# EAGLE board PFCEDU_V1 (EAGLE 8.6.1), part 1 of 2
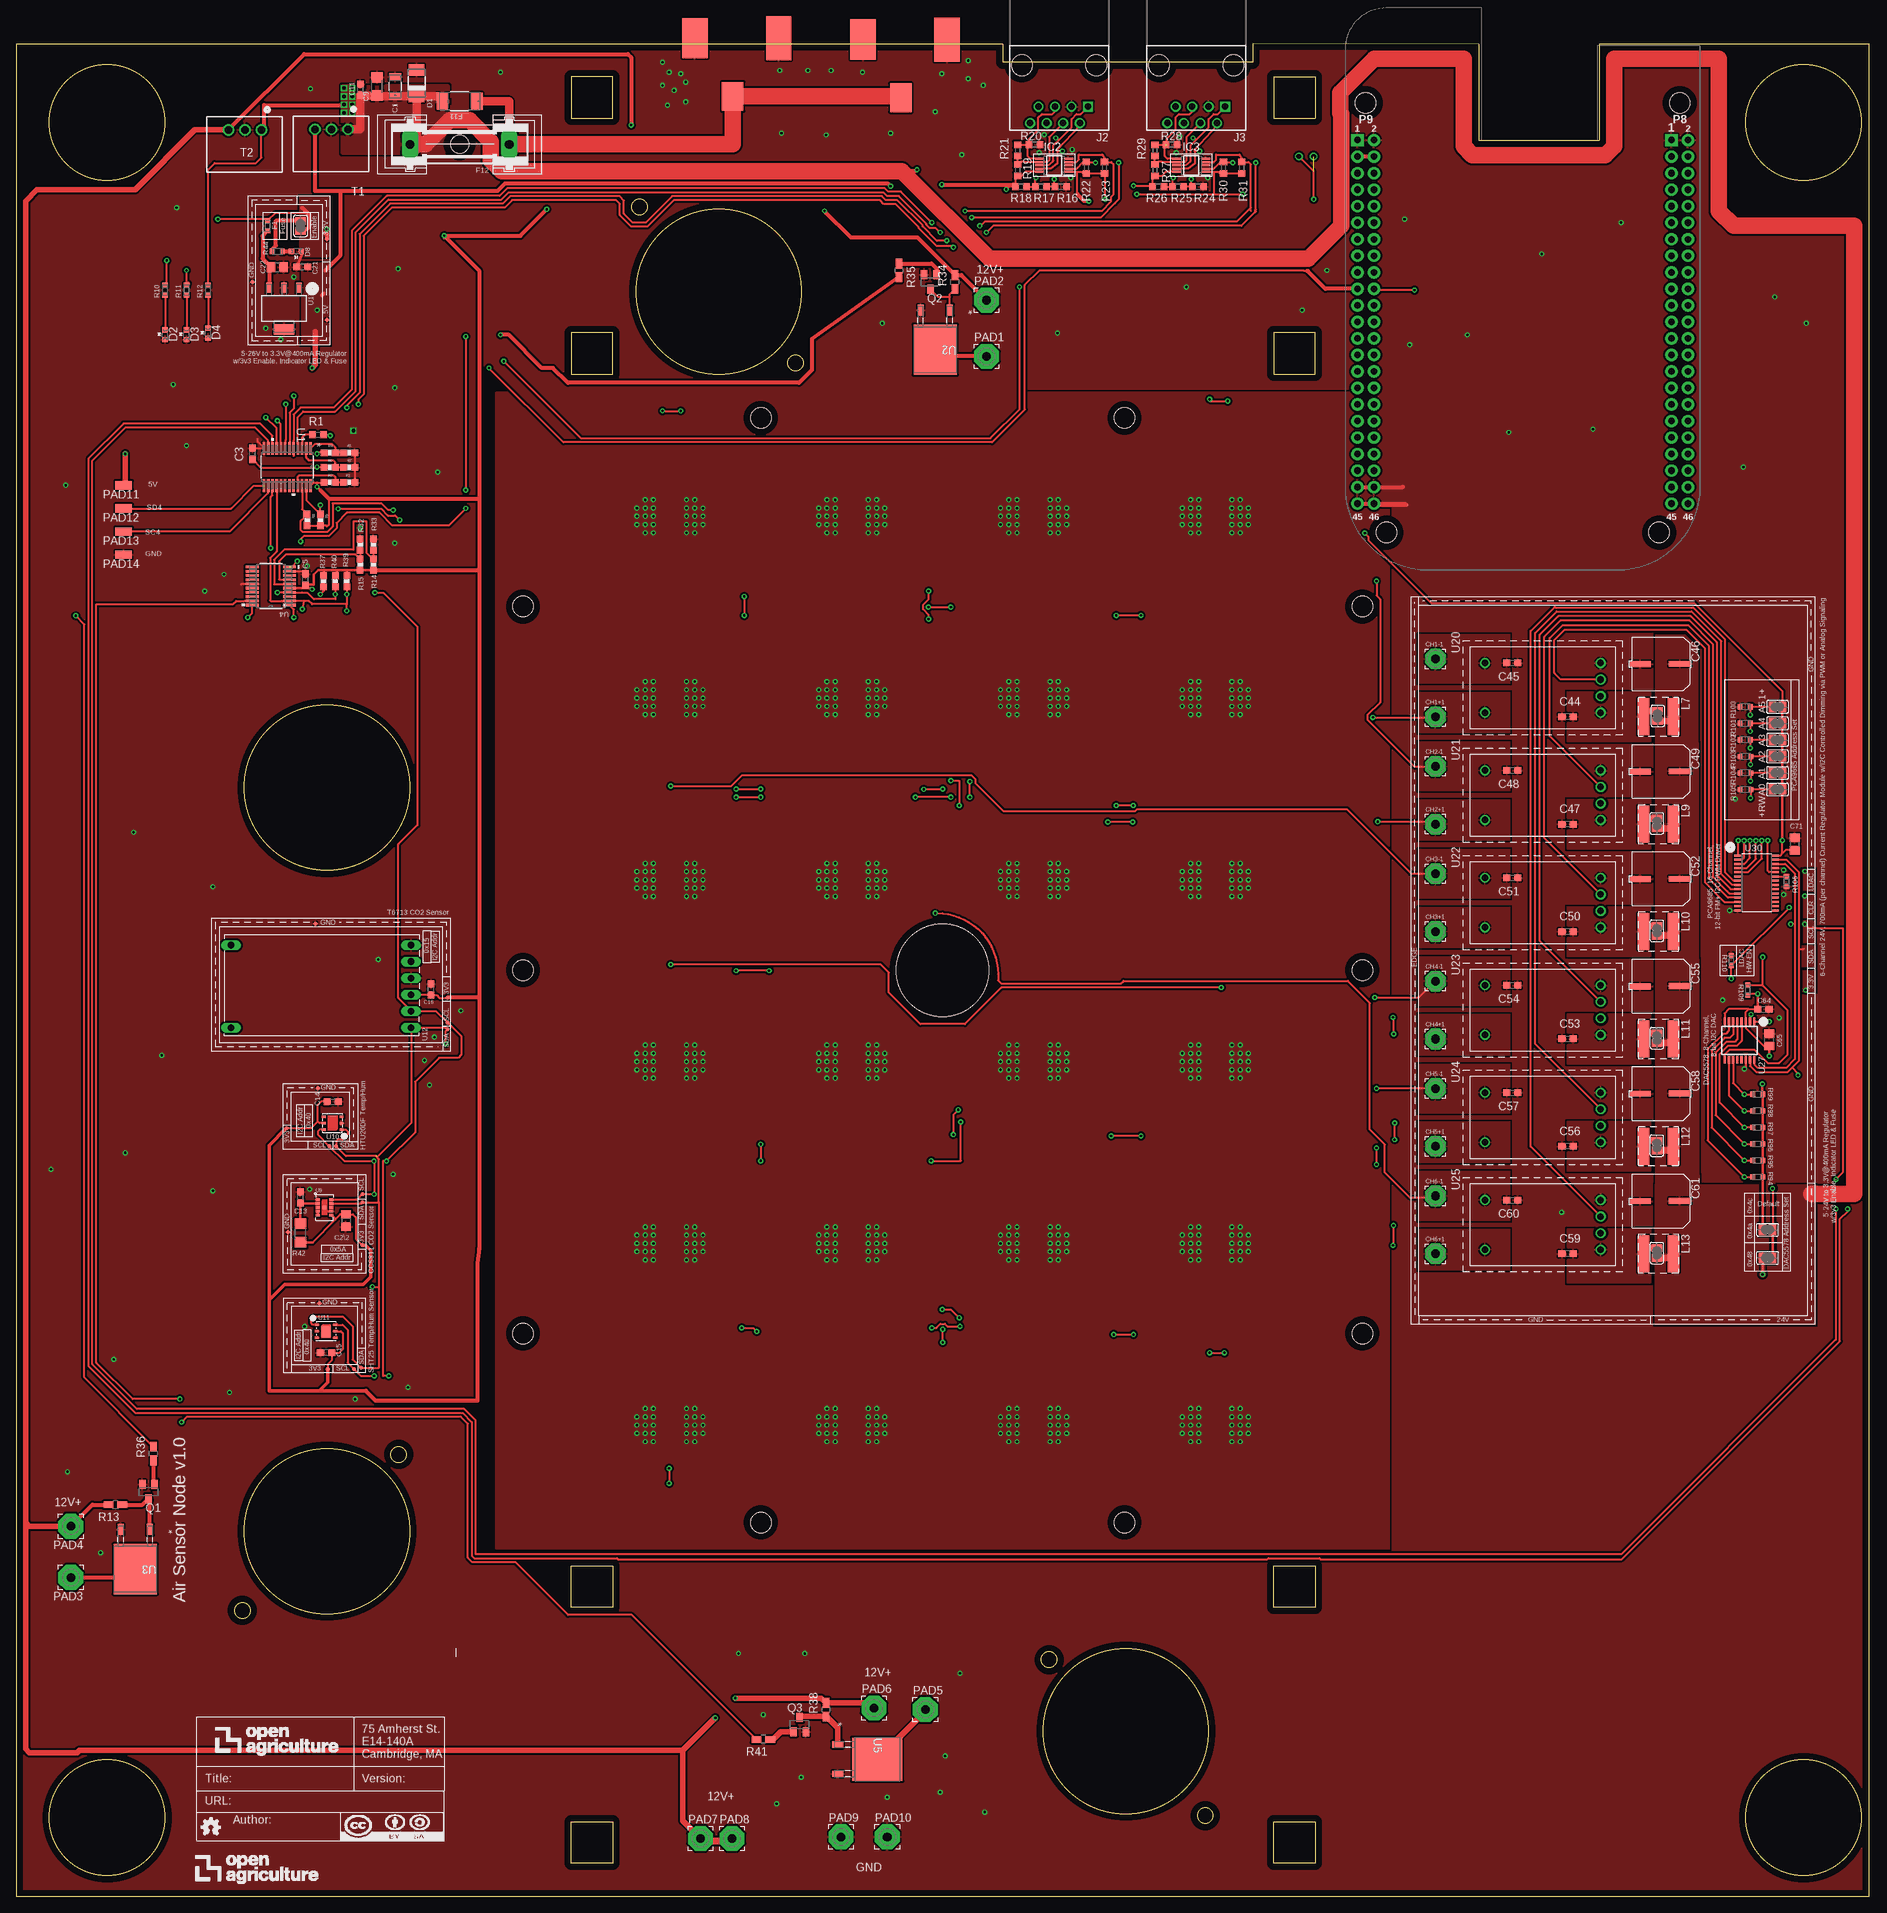
[diagram p6: board, top side]
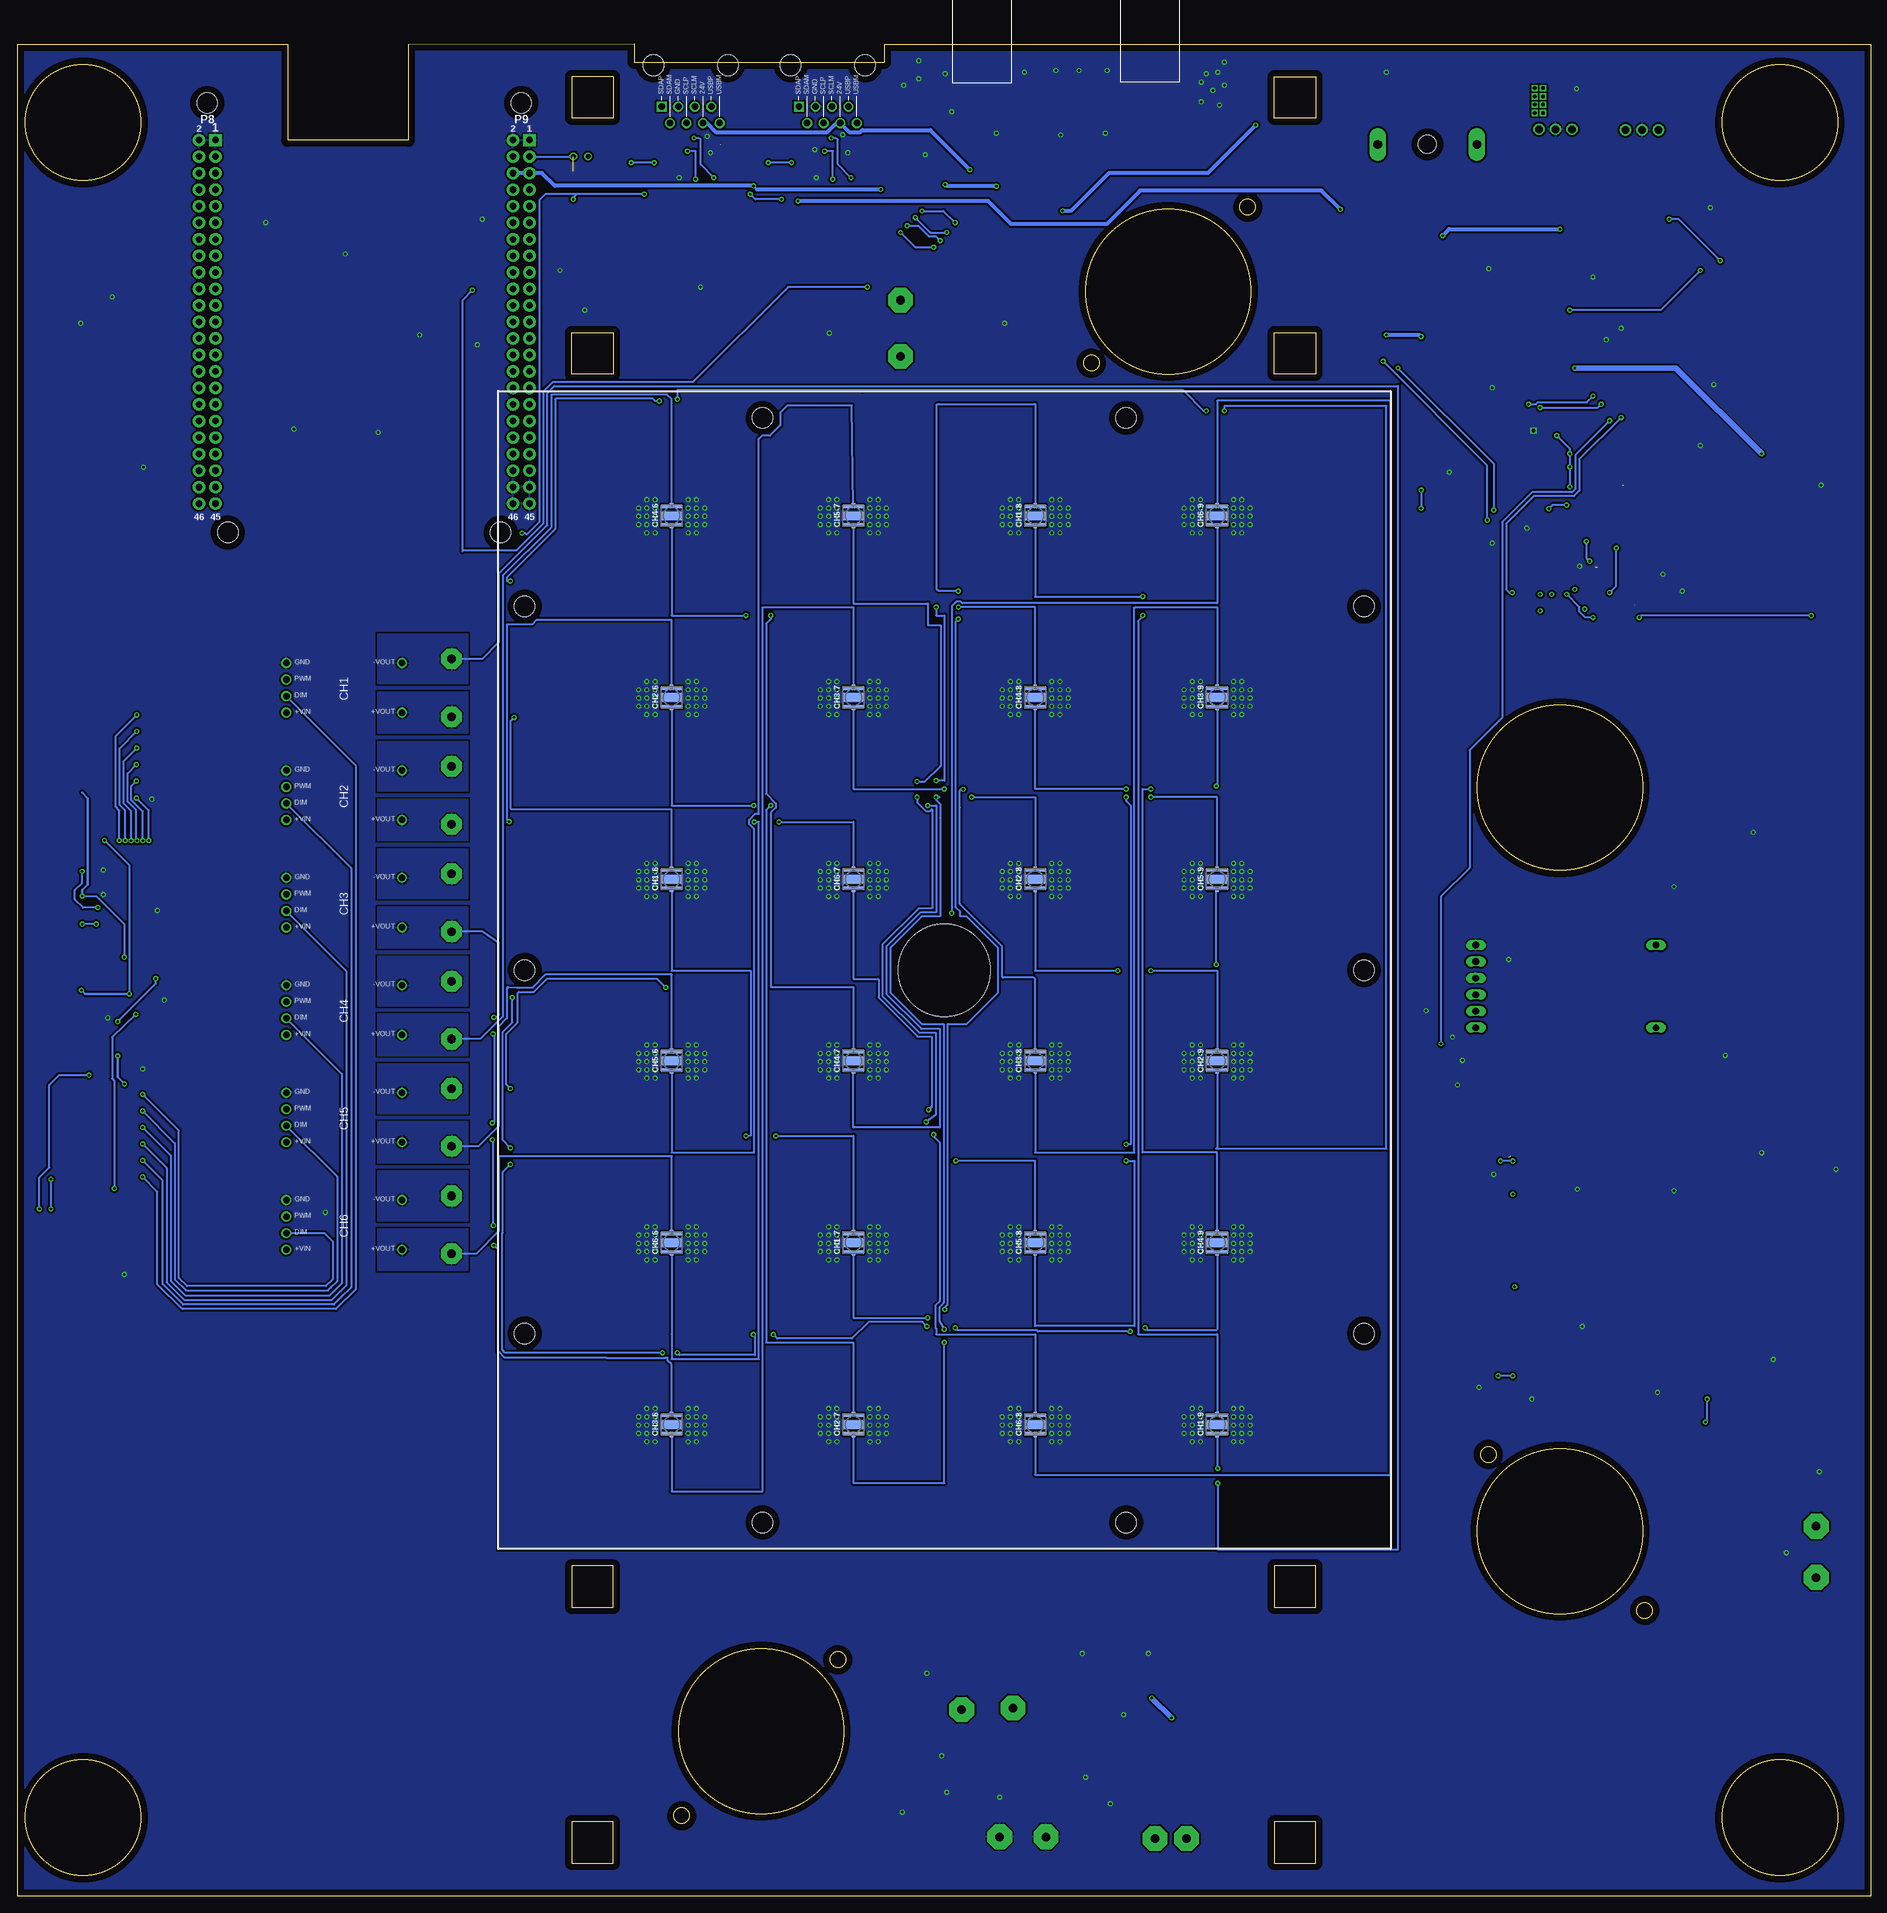
[diagram p7: board, bottom side, seen from below]

Size 284.73 x 284.79 mm. Coordinates in mm from the lower left corner, seen from the top.
Outline: 189.99,281.94 151.62,281.94 151.62,284.73 0,284.73 0,0 284.73,0 284.73,284.73 243.27,284.73 243.27,269.95 224.73,269.95 224.73,284.73 189.99,284.79 189.99,281.94
Outline: 91.66,279.71 85.31,279.71 85.31,273.36 91.66,273.36 91.66,279.71
Outline: 91.66,240.34 85.31,240.34 85.31,233.99 91.66,233.99 91.66,240.34
Outline: 199.61,240.34 193.26,240.34 193.26,233.99 199.61,233.99 199.61,240.34
Outline: 193.26,273.36 199.61,273.36 199.61,279.71 193.26,279.71 193.26,273.36
Outline: 199.61,11.43 199.61,5.08 193.26,5.08 193.26,11.43 199.61,11.43
Outline: 199.61,50.8 199.61,44.45 193.26,44.45 193.26,50.8 199.61,50.8
Outline: 91.66,11.43 91.66,5.08 85.31,5.08 85.31,11.43 91.66,11.43
Outline: 91.66,50.8 91.66,44.45 85.31,44.45 85.31,50.8 91.66,50.8
Outline: circle at 274.7,12.1 radius 8.89
Outline: circle at 13.97,12.1 radius 8.89
Outline: circle at 119.75,235.7 radius 1.2
Outline: circle at 95.76,259.68 radius 1.2
Outline: circle at 158.73,36.4 radius 1.2
Outline: circle at 182.72,12.41 radius 1.2
Outline: circle at 58.75,67.93 radius 1.2
Outline: circle at 34.76,43.94 radius 1.2
Outline: circle at 47.75,170.43 radius 12.7
Outline: circle at 47.75,56.13 radius 12.7
Outline: circle at 274.7,272.69 radius 8.89
Outline: circle at 170.53,25.4 radius 12.7
Outline: circle at 107.95,246.69 radius 12.7
Outline: circle at 13.97,272.69 radius 8.89
Copper layers (1*16): Top 0.035mm / dielectric 1.5mm / Bottom 0.035mm
Design rules "default *": minimum track width 6mil, minimum drill 0.35mm, track to track 4mil, track to pad 4mil, pad to pad 6mil, via to via 6mil, smd to smd 6mil, copper to edge 40mil, drill to drill 6mil, minimum pad ring 10mil, minimum via ring 8mil, stop-mask expansion 4mil, vias tented up to drill 25mil, thermal gap 10mil
Holes 3.17 mm at 114.43,57.48 170.31,57.48 206.86,86.51 206.86,142.39 206.86,198.27 170.31,227.28 114.43,227.28 77.88,198.27 77.88,142.39 77.88,86.51
Holes 14.22 mm at 142.37,142.37
Milling: 2 lines

## Footprints (pad centres in the part's own frame; a part is rotated, then mirrored left to right if it is on the bottom)
CAP_C1206 = smd 1.118 x 1.803: 1 -1.499,0; 2 1.499,0
C0805 = smd 1.3 x 1.5: 1 -0.95,0; 2 0.95,0
C0603@1 = smd 1.1 x 1: 1 -0.85,0; 2 0.85,0
C1206 = smd 1.6 x 1.8: 1 -1.4,0; 2 1.4,0
C0603 = smd 1.1 x 1: 1 -0.85,0; 2 0.85,0
EEE-1HA101UP = smd 0.889 x 3.404: + 0,-3.251 | smd 0.889 x 3.251: - -0.051,2.794
3,17/1,3 = drill 1.321 pad 3.175 octagon: 1 0,0
CREE-XLAMP-XP-E = smd 0.5 x 3.3: A 1.4,0; C -1.4,0 | smd 0.45 x 0.5: A@1 1.725,0; C@1 -1.725,0 | smd 1.3 x 3.3: THERM 0,0
DO-214AC = smd 1.8 x 2.4: A 2.025,0; C -2.025,0
CHIPLED_0603 = smd 0.8 x 0.8: A 0,-0.75; C 0,0.75
0603 = smd 0.756 x 0.8: 1 -0.778,0; 2 0.778,0
SS = smd 1.803 x 2.642: 1 -2.629,0; 2 2.629,0
GSH15 = drill 1.321 pad 2.54 long: 1 -7.62,0; 2 7.62,0 | hole 2.794: 0,0
SOP50P490X110-10N = smd 1.4 x 0.3: 1 -2.2,1; 2 -2.2,0.5; 3 -2.2,0; 4 -2.2,-0.5; 5 -2.2,-1; 6 2.2,-1; 7 2.2,-0.5; 8 2.2,0; 9 2.2,0.5; 10 2.2,1
OPENAG-V1-RJ45 = drill 1: 24V(6) 1.905,8.89; DSCLM(5) 0.635,6.35; DSCLP(4) -0.635,8.89; DSDAM(2) -3.175,8.89; GND(3) -1.905,6.35; USBM(8) 4.445,8.89; USBP(7) 3.175,6.35 | drill 1 square: DSDAP(1) -4.445,6.35 | hole 3.2: -5.715,0; 5.715,0
74404064121 = smd 1.8 x 5.7: 1 -2.3,0; 2 2.3,0
3,81/1,3 = drill 1.321 pad 3.81 octagon: 1 0,0
SMD1,27-2,54 = smd 1.27 x 2.54: 1 0,0
SOT23-BEC = smd 1 x 1.4: B -0.95,-1.1; C 0,1.1; E 0.95,-1.1
R0603 = smd 1 x 1.1: 1 -0.85,0; 2 0.85,0
0603-RES = smd 1.1 x 1: 1 -0.85,0; 2 0.85,0
RC0603N = smd 0.756 x 0.8: 1 -0.778,0; 2 0.778,0
R0805W = smd 1.5 x 1: 1 -1.052,0; 2 1.052,0
R1206 = smd 1.6 x 1.803: 1 -1.422,0; 2 1.422,0
SOLDERJUMPER_REFLOW_NOPASTE = smd 1.168 x 1.6: 1 -0.762,0; 2 0.762,0
R-78E5.0-1.0 = drill 1.15 pad 1.75: 1 3.21,2; 2 5.75,2; 3 8.29,2
TP06R = smd 0.6 x 0.6: TP 0,0
PW24-M = smd 1.981 x 0.406: 1 -2.87,3.575; 2 -2.87,2.925; 3 -2.87,2.275; 4 -2.87,1.625; 5 -2.87,0.975; 6 -2.87,0.325; 7 -2.87,-0.325; 8 -2.87,-0.975; 9 -2.87,-1.625; 10 -2.87,-2.275; 11 -2.87,-2.925; 12 -2.87,-3.575; 13 2.87,-3.575; 14 2.87,-2.925; 15 2.87,-2.275; 16 2.87,-1.625; 17 2.87,-0.975; 18 2.87,-0.325; 19 2.87,0.325; 20 2.87,0.975; 21 2.87,1.625; 22 2.87,2.275; 23 2.87,2.925; 24 2.87,3.575
DPAK = smd 0.94 x 1.702: 1 -2.25,-6.109; 2 2.25,-6.109 | smd 6.655 x 7.722: 3 0,0
PW20-M = smd 1.981 x 0.406: 1 -2.87,2.925; 2 -2.87,2.275; 3 -2.87,1.625; 4 -2.87,0.975; 5 -2.87,0.325; 6 -2.87,-0.325; 7 -2.87,-0.975; 8 -2.87,-1.625; 9 -2.87,-2.275; 10 -2.87,-2.925; 11 2.87,-2.925; 12 2.87,-2.275; 13 2.87,-1.625; 14 2.87,-0.975; 15 2.87,-0.325; 16 2.87,0.325; 17 2.87,0.975; 18 2.87,1.625; 19 2.87,2.275; 20 2.87,2.925
CCS811 = smd 0.6 x 0.4: 1 -1.05,1.2; 2 -1.05,0.6; 3 -1.05,0; 4 -1.05,-0.6; 5 -1.05,-1.2; 6 1.05,-1.2; 7 1.05,-0.6; 8 1.05,0; 9 1.05,0.6; 10 1.05,1.2; EP 0,0
HTU20D(F) = smd 0.4 x 0.6: 1 -1,-1.35; 2 0,-1.35; 3 1,-1.35; 4 1,1.35; 5 0,1.35; 6 -1,1.35
SHT2X = smd 0.3 x 0.4: 1 -1,-1.4; 2 0,-1.4; 3 1,-1.4; 4 1,1.4; 5 0,1.4; 6 -1,1.4 | smd 1.651 x 1.27: 7 0,0
T6713 = drill 1.016 long: 1 1.27,-1.27; 2 1.27,-3.81; 3 1.27,-6.35; 4 1.27,-8.89; 5 1.27,-11.43; 6 1.27,-13.97; 7 28.96,-13.97; 8 28.96,-1.27
MP04A = smd 1.6 x 0.838: 1 -3.2,2.3; 2 -3.2,0; 3 -3.2,-2.3 | smd 1.6 x 3.099: 4 3.2,0
RCD-24-PINNED = drill 1: 1 0,0; 2 0,-2.54; 3 0,-5.08; 4 0,-7.62; 5 17.78,-7.62; 6 17.78,0
TSSOP16 = smd 0.35 x 1.2: 1 -2.275,-2.925; 2 -1.625,-2.925; 3 -0.975,-2.925; 4 -0.325,-2.925; 5 0.325,-2.925; 6 0.975,-2.925; 7 1.625,-2.925; 8 2.275,-2.925; 9 2.275,2.925; 10 1.625,2.925; 11 0.975,2.925; 12 0.325,2.925; 13 -0.325,2.925; 14 -0.975,2.925; 15 -1.625,2.925; 16 -2.275,2.925
TSSOP28 = smd 0.305 x 0.991: 1 -4.225,-2.918; 2 -3.575,-2.918; 3 -2.925,-2.918; 4 -2.275,-2.918; 5 -1.625,-2.918; 6 -0.975,-2.918; 7 -0.325,-2.918; 8 0.325,-2.918; 9 0.975,-2.918; 10 1.625,-2.918; 11 2.275,-2.918; 12 2.925,-2.918; 13 3.575,-2.918; 14 4.225,-2.918; 15 4.225,2.918; 16 3.575,2.918; 17 2.925,2.918; 18 2.275,2.918; 19 1.625,2.918; 20 0.975,2.918; 21 0.325,2.918; 22 -0.325,2.918; 23 -0.975,2.918; 24 -1.625,2.918; 25 -2.275,2.918; 26 -2.925,2.918; 27 -3.575,2.918; 28 -4.225,2.918
PJ-036AH = smd 4.4 x 3.3: 1 2.2,-0.65 | smd 6.75 x 3.9: 2 -6.75,6.45 | smd 6.2 x 3.9: 3 -6.75,-6.45
BEAGLE_BONE_BLACK_CAPE = drill 1.016 pad 1.88 square: P8.1 20.32,50.165; P9.1 20.32,1.905 | drill 1.016 pad 1.88: P8.2 20.32,52.705; P8.3 22.86,50.165; P8.4 22.86,52.705; P8.5 25.4,50.165; P8.6 25.4,52.705; P8.7 27.94,50.165; P8.8 27.94,52.705; P8.9 30.48,50.165; P8.10 30.48,52.705; P8.11 33.02,50.165; P8.12 33.02,52.705; P8.13 35.56,50.165; P8.14 35.56,52.705; P8.15 38.1,50.165; P8.16 38.1,52.705; P8.17 40.64,50.165; P8.18 40.64,52.705; P8.19 43.18,50.165; P8.20 43.18,52.705; P8.21 45.72,50.165; P8.22 45.72,52.705; P8.23 48.26,50.165; P8.24 48.26,52.705; P8.25 50.8,50.165; P8.26 50.8,52.705; P8.27 53.34,50.165; P8.28 53.34,52.705; P8.29 55.88,50.165; P8.30 55.88,52.705; P8.31 58.42,50.165; P8.32 58.42,52.705; P8.33 60.96,50.165; P8.34 60.96,52.705; P8.35 63.5,50.165; P8.36 63.5,52.705; P8.37 66.04,50.165; P8.38 66.04,52.705; P8.39 68.58,50.165; P8.40 68.58,52.705; P8.41 71.12,50.165; P8.42 71.12,52.705; P8.43 73.66,50.165; P8.44 73.66,52.705; P8.45 76.2,50.165; P8.46 76.2,52.705; P9.2 20.32,4.445; P9.3 22.86,1.905; P9.4 22.86,4.445; P9.5 25.4,1.905; P9.6 25.4,4.445; P9.7 27.94,1.905; P9.8 27.94,4.445; P9.9 30.48,1.905; P9.10 30.48,4.445; P9.11 33.02,1.905; P9.12 33.02,4.445; P9.13 35.56,1.905; P9.14 35.56,4.445; P9.15 38.1,1.905; P9.16 38.1,4.445; P9.17 40.64,1.905; P9.18 40.64,4.445; P9.19 43.18,1.905; P9.20 43.18,4.445; P9.21 45.72,1.905; P9.22 45.72,4.445; P9.23 48.26,1.905; P9.24 48.26,4.445; P9.25 50.8,1.905; P9.26 50.8,4.445; P9.27 53.34,1.905; P9.28 53.34,4.445; P9.29 55.88,1.905; P9.30 55.88,4.445; P9.31 58.42,1.905; P9.32 58.42,4.445; P9.33 60.96,1.905; P9.34 60.96,4.445; P9.35 63.5,1.905; P9.36 63.5,4.445; P9.37 66.04,1.905; P9.38 66.04,4.445; P9.39 68.58,1.905; P9.40 68.58,4.445; P9.41 71.12,1.905; P9.42 71.12,4.445; P9.43 73.66,1.905; P9.44 73.66,4.445; P9.45 76.2,1.905; P9.46 76.2,4.445 | hole 3.175: 14.605,3.175; 80.645,6.35; 80.645,48.26; 14.605,51.435

## Placement (x,y rotation side)
ATTRIBUTES  [DOCFIELD]  27.7,8.53 0 top
C1  4.7uF  [CAP_C1206]  58.23,278.22 90 top
C2\2  4.7uF  [C0805]  50.66,103.88 270 top
C3  .1uF  [C0603@1]  36.31,221.75 90 top
C5  .1uF  [C0603@1]  44.45,202.44 90 top
C9  10uF  [C1206]  55.44,278.22 90 top
C11  .1uF  [C0603@1]  52.9,277.71 90 top
C13  0.1uF  [C0603]  43.68,107.43 90 top
C14  0.1uF  [C0603]  48.63,122.17 0 top
C15  0.1uF  [C0603]  47.61,83.56 180 top
C16  0.1uF  [C0603]  63.74,139.39 90 top
C21  0.1uF  [C0603]  43.94,250.44 180 top
C22  10uF  [C0805]  40.13,250.44 0 top
C44  10nF  [C0603]  238.4,181.33 180 top
C45  10nF  [C0603]  229.9,189.59 0 top
C46  100uF  [EEE-1HA101UP]  252.37,189.46 90 top
C47  10nF  [C0603]  238.4,164.82 180 top
C48  10nF  [C0603]  229.9,173.08 0 top
C49  100uF  [EEE-1HA101UP]  252.37,172.95 90 top
C50  10nF  [C0603]  238.4,148.31 180 top
C51  10nF  [C0603]  229.9,156.57 0 top
C52  100uF  [EEE-1HA101UP]  252.37,156.44 90 top
C53  10nF  [C0603]  238.4,131.8 180 top
C54  10nF  [C0603]  229.9,140.06 0 top
C55  100uF  [EEE-1HA101UP]  252.37,139.93 90 top
C56  10nF  [C0603]  238.4,115.29 180 top
C57  10nF  [C0603]  229.9,123.55 0 top
C58  100uF  [EEE-1HA101UP]  252.37,123.42 90 top
C59  10nF  [C0603]  238.4,98.78 180 top
C60  10nF  [C0603]  229.9,107.04 0 top
C61  100uF  [EEE-1HA101UP]  252.37,106.91 90 top
C64  0.1uF  [C0603]  268.5,136.37 0 top
C65  4.7uF  [C0805]  269.39,131.67 90 top
C71  10uF  [C0805]  273.33,161.77 90 top
CH1+1  [3,17/1,3]  218.08,181.33 0 top
CH1-1  [3,17/1,3]  218.08,190.22 0 top
CH1-6  XP-E  [CREE-XLAMP-XP-E]  184.28,156.36 90 bottom
CH1-7  XP-E  [CREE-XLAMP-XP-E]  156.34,100.48 90 bottom
CH1-8  XP-E  [CREE-XLAMP-XP-E]  128.4,212.24 90 bottom
CH1-9  XP-E  [CREE-XLAMP-XP-E]  100.46,72.54 90 bottom
CH2+1  [3,17/1,3]  218.08,164.82 0 top
CH2-1  [3,17/1,3]  218.08,173.71 0 top
CH2-6  XP-E  [CREE-XLAMP-XP-E]  184.28,184.3 90 bottom
CH2-7  XP-E  [CREE-XLAMP-XP-E]  156.34,72.54 90 bottom
CH2-8  XP-E  [CREE-XLAMP-XP-E]  128.4,156.36 90 bottom
CH2-9  XP-E  [CREE-XLAMP-XP-E]  100.46,128.42 90 bottom
CH3+1  [3,17/1,3]  218.08,148.31 0 top
CH3-1  [3,17/1,3]  218.08,157.2 0 top
CH3-6  XP-E  [CREE-XLAMP-XP-E]  184.28,72.54 90 bottom
CH3-7  XP-E  [CREE-XLAMP-XP-E]  156.34,184.3 90 bottom
CH3-8  XP-E  [CREE-XLAMP-XP-E]  128.4,128.42 90 bottom
CH3-9  XP-E  [CREE-XLAMP-XP-E]  100.46,184.3 90 bottom
CH4+1  [3,17/1,3]  218.08,131.8 0 top
CH4-1  [3,17/1,3]  218.08,140.69 0 top
CH4-6  XP-E  [CREE-XLAMP-XP-E]  184.28,212.24 90 bottom
CH4-7  XP-E  [CREE-XLAMP-XP-E]  156.34,128.42 90 bottom
CH4-8  XP-E  [CREE-XLAMP-XP-E]  128.4,184.3 90 bottom
CH4-9  XP-E  [CREE-XLAMP-XP-E]  100.46,100.48 90 bottom
CH5+1  [3,17/1,3]  218.08,115.29 0 top
CH5-1  [3,17/1,3]  218.08,124.18 0 top
CH5-6  XP-E  [CREE-XLAMP-XP-E]  184.28,128.42 90 bottom
CH5-7  XP-E  [CREE-XLAMP-XP-E]  156.34,212.24 90 bottom
CH5-8  XP-E  [CREE-XLAMP-XP-E]  128.4,100.48 90 bottom
CH5-9  XP-E  [CREE-XLAMP-XP-E]  100.46,156.36 90 bottom
CH6+1  [3,17/1,3]  218.08,98.78 0 top
CH6-1  [3,17/1,3]  218.08,107.67 0 top
CH6-6  XP-E  [CREE-XLAMP-XP-E]  184.28,100.48 90 bottom
CH6-7  XP-E  [CREE-XLAMP-XP-E]  156.34,156.36 90 bottom
CH6-8  XP-E  [CREE-XLAMP-XP-E]  128.4,72.54 90 bottom
CH6-9  XP-E  [CREE-XLAMP-XP-E]  100.46,212.24 90 bottom
D1  SMAJ14A  [DO-214AC]  61.54,278.72 90 top
D2  APT1608CGCK  [CHIPLED_0603]  22.87,240.04 180 top
D3  APT1608CGCK  [CHIPLED_0603]  26.17,240.04 180 top
D4  APT1608CGCK  [CHIPLED_0603]  29.47,240.29 180 top
D8  APT1608CGCK  [CHIPLED_0603]  43.05,252.86 270 top
F1  0448.400MR  [0603]  38.61,256.79 90 top
F11  SST 7  [SS]  68.14,275.93 180 top
F12  [GSH15]  68.14,269.33 180 top
IC2  PCA9615DP  [SOP50P490X110-10N]  159.5,266.11 180 top
IC3  PCA9615DP  [SOP50P490X110-10N]  180.58,266.11 180 top
J2  54602-908LF  [OPENAG-V1-RJ45]  160.26,281.48 180 top
J3  54602-908LF  [OPENAG-V1-RJ45]  181.35,281.48 180 top
L7  120uH  [74404064121]  252.37,181.33 180 top
L9  120uH  [74404064121]  252.37,164.82 180 top
L10  120uH  [74404064121]  252.37,148.31 180 top
L11  120uH  [74404064121]  252.37,131.8 180 top
L12  120uH  [74404064121]  252.37,115.29 180 top
L13  120uH  [74404064121]  252.37,98.78 180 top
PAD1  WIREPAD3,81/1,3  [3,81/1,3]  149.1,236.73 0 top
PAD2  WIREPAD3,81/1,3  [3,81/1,3]  149.1,245.36 0 top
PAD3  WIREPAD3,81/1,3  [3,81/1,3]  8.38,49.02 180 top
PAD4  WIREPAD3,81/1,3  [3,81/1,3]  8.38,56.9 180 top
PAD5  WIREPAD3,81/1,3  [3,81/1,3]  139.7,28.7 0 top
PAD6  WIREPAD3,81/1,3  [3,81/1,3]  131.83,28.96 0 top
PAD7  WIREPAD3,81/1,3  [3,81/1,3]  105.16,8.89 0 top
PAD8  WIREPAD3,81/1,3  [3,81/1,3]  109.98,8.89 0 top
PAD9  WIREPAD3,81/1,3  [3,81/1,3]  126.75,9.14 0 top
PAD10  WIREPAD3,81/1,3  [3,81/1,3]  133.86,9.14 0 top
PAD11  [SMD1,27-2,54]  16.51,216.92 90 top
PAD12  [SMD1,27-2,54]  16.51,213.36 90 top
PAD13  [SMD1,27-2,54]  16.51,209.8 90 top
PAD14  [SMD1,27-2,54]  16.51,206.25 90 top
Q1  MMBT2222A  [SOT23-BEC]  20.32,62.23 180 top
Q2  MMBT2222A  [SOT23-BEC]  140.46,248.16 180 top
Q3  MMBT2222A  [SOT23-BEC]  120.4,26.42 0 top
R1  10K  [R0603]  46.35,224.67 0 top
R2  10K  [0603-RES]  48.18,217.36 180 top
R3  10K  [0603-RES]  51.17,217.36 180 top
R4  10K  [0603-RES]  48.2,221.9 180 top
R5  10K  [0603-RES]  51.17,221.9 180 top
R6  10K  [0603-RES]  48.18,219.64 180 top
R7  10K  [0603-RES]  51.17,219.64 180 top
R8  10K  [0603-RES]  44.71,211.59 270 top
R9  10K  [0603-RES]  46.73,211.59 270 top
R10  100  [RC0603N]  22.87,246.9 90 top
R11  100  [RC0603N]  26.17,246.9 90 top
R12  100  [RC0603N]  29.47,246.9 90 top
R13  [R0805W]  15.24,60.2 180 top
R14  10K  [0603-RES]  54.86,204.72 270 top
R15  10K  [0603-RES]  52.83,204.72 270 top
R16  600  [R0603]  160.52,262.81 0 top
R17  120  [R0603]  157.47,262.81 0 top
R18  600  [R0603]  154.42,262.81 0 top
R19  600  [R0603]  153.91,265.35 270 top
R20  600  [R0603]  156.45,269.28 180 top
R21  120  [R0603]  153.91,268.39 270 top
R22  10K  [R0603]  164.45,265.73 270 top
R23  10K  [R0603]  167.25,265.73 270 top
R24  600  [R0603]  181.6,262.81 0 top
R25  120  [R0603]  178.55,262.81 0 top
R26  600  [R0603]  175.5,262.81 0 top
R27  600  [R0603]  175,265.35 270 top
R28  600  [R0603]  177.54,269.28 180 top
R29  120  [R0603]  175,268.39 270 top
R30  10K  [R0603]  185.54,265.73 270 top
R31  10K  [R0603]  188.33,265.73 270 top
R32  10K  [0603-RES]  52.83,207.77 270 top
R33  10K  [0603-RES]  54.86,207.77 270 top
R34  [R0805W]  144.27,248.16 90 top
R35  [R0805W]  135.64,249.94 270 top
R36  [R0805W]  21.08,68.07 90 top
R37  10K  [0603-RES]  47.24,202.18 90 top
R38  [R0805W]  124.46,28.7 90 top
R39  10K  [0603-RES]  50.8,202.18 90 top
R40  10K  [0603-RES]  49.02,202.18 90 top
R41  [R0805W]  114.81,24.13 180 top
R42  4.7K  [R1206]  43.68,101.97 270 top
R44  100  [RC0603N]  40.13,252.86 180 top
R94  1K  [RC0603N]  267.61,110.59 180 top
R95  1K  [RC0603N]  267.61,113.13 180 top
R96  1K  [RC0603N]  267.61,115.67 180 top
R97  1K  [RC0603N]  267.61,118.21 180 top
R98  1K  [RC0603N]  267.61,120.75 180 top
R99  1K  [RC0603N]  267.61,123.29 180 top
R100  10K  [RC0603N]  265.72,182.85 0 top
R101  10K  [RC0603N]  265.72,180.31 0 top
R102  10K  [RC0603N]  265.72,177.77 0 top
R103  10K  [RC0603N]  265.75,175.23 0 top
R104  10K  [RC0603N]  265.75,172.69 0 top
R105  10K  [RC0603N]  265.75,170.15 0 top
R106  10K  [RC0603N]  272.03,155.99 270 top
R109  1K  [RC0603N]  266.09,139.29 90 top
R110  0 OHM  [RC0603N]  263.55,143.87 270 top
SJ1  [SOLDERJUMPER_REFLOW_NOPASTE]  43.69,256.79 270 top
SJ_A18  [SOLDERJUMPER_REFLOW_NOPASTE]  270.66,170.15 180 top
SJ_A19  [SOLDERJUMPER_REFLOW_NOPASTE]  270.66,172.69 180 top
SJ_A20  [SOLDERJUMPER_REFLOW_NOPASTE]  270.66,175.23 180 top
SJ_A21  [SOLDERJUMPER_REFLOW_NOPASTE]  270.66,177.77 180 top
SJ_A22  [SOLDERJUMPER_REFLOW_NOPASTE]  270.66,180.31 180 top
SJ_A23  [SOLDERJUMPER_REFLOW_NOPASTE]  270.66,182.85 180 top
SJ_A24  [SOLDERJUMPER_REFLOW_NOPASTE]  252.25,181.46 270 top
SJ_A25  [SOLDERJUMPER_REFLOW_NOPASTE]  252.12,164.95 270 top
SJ_A26  [SOLDERJUMPER_REFLOW_NOPASTE]  252.12,148.44 270 top
SJ_A27  [SOLDERJUMPER_REFLOW_NOPASTE]  252.12,131.93 270 top
SJ_A28  [SOLDERJUMPER_REFLOW_NOPASTE]  252.12,115.42 270 top
SJ_A29  [SOLDERJUMPER_REFLOW_NOPASTE]  252.12,98.91 270 top
SJ_A34  [SOLDERJUMPER_REFLOW_NOPASTE]  269.14,102.46 0 top
SJ_A35  [SOLDERJUMPER_REFLOW_NOPASTE]  269.14,98.15 0 top
T1  R-78E5.0-1.0  [R-78E5.0-1.0]  54.17,273.64 180 top
T2  R-78E12.0-1.0  [R-78E5.0-1.0]  40.89,273.56 180 top
TP1  TPTP06R  [TP06R]  53.2,107.94 180 top
TP2  TPTP06R  [TP06R]  53.2,106.67 180 top
TP3  TPTP06R  [TP06R]  41.77,102.1 180 top
TP5  TPTP06R  [TP06R]  53.2,100.07 180 top
TP6  TPTP06R  [TP06R]  49.14,115.31 90 top
TP7  TPTP06R  [TP06R]  48.12,115.31 90 top
TP36  TPTP06R  [TP06R]  41.52,118.1 90 top
TP37  TPTP06R  [TP06R]  46.34,124.2 90 top
TP38  TPTP06R  [TP06R]  52.95,81.27 90 top
TP39  TPTP06R  [TP06R]  51.93,81.02 90 top
TP40  TPTP06R  [TP06R]  46.6,91.18 90 top
TP41  TPTP06R  [TP06R]  47.87,81.02 90 top
TP42  TPTP06R  [TP06R]  66.28,133.29 180 top
TP43  TPTP06R  [TP06R]  66.28,134.31 180 top
TP44  TPTP06R  [TP06R]  66.28,138.12 180 top
TP45  TPTP06R  [TP06R]  45.96,149.55 180 top
TP61  TPTP06R  [TP06R]  36.32,248.16 270 top
TP62  TPTP06R  [TP06R]  47.75,242.32 270 top
TP63  TPTP06R  [TP06R]  47.75,254.76 270 top
U1  TCA9548APWRPW24-M  [PW24-M]  41.65,219.72 270 top
U2  STD12NF06LT4  [DPAK]  141.22,237.74 180 top
U3  STD12NF06LT4  [DPAK]  18.29,50.29 180 top
U4  PCF8574APWRPW20-M  [PW20-M]  39.12,201.42 180 top
U5  STD12NF06LT4  [DPAK]  132.33,21.08 270 top
U9  CCS811  [CCS811]  47.36,105.91 0 top
U10  HPP845E034R5  [HTU20D(F)]  48.63,118.86 90 top
U11  SHT25  [SHT2X]  47.61,86.86 270 top
U12  T6713-5K  [T6713]  61.96,132.27 180 top
U17  LM2937IMP3.3NOPB  [MP04A]  41.15,244.09 270 top
U20  RCD-24-0.70/VREF  [RCD-24-PINNED]  243.48,181.97 180 top
U21  RCD-24-0.70/VREF  [RCD-24-PINNED]  243.48,165.46 180 top
U22  RCD-24-0.70/VREF  [RCD-24-PINNED]  243.48,148.95 180 top
U23  RCD-24-0.70/VREF  [RCD-24-PINNED]  243.48,132.44 180 top
U24  RCD-24-0.70/VREF  [RCD-24-PINNED]  243.48,115.93 180 top
U25  RCD-24-0.70/VREF  [RCD-24-PINNED]  243.48,99.42 180 top
U27  DAC5578SPW  [TSSOP16]  264.82,131.55 180 top
U30  PCA9685  [TSSOP28]  267.46,155.8 270 top
U$1  PJ-036AH  [PJ-036AH]  110.73,278.88 270 top
U$2  BEAGLE_BONE_BLACK_CAPE  [BEAGLE_BONE_BLACK_CAPE]  204.21,290.29 270 top
U$3  PJ-036AH  [PJ-036AH]  136.59,278.68 270 top
U$9  [OPENAG-LOGO-750-MIL]  27.55,2.32 0 top